# Altium schematic sheet [4] MCU.SchDoc
size A3
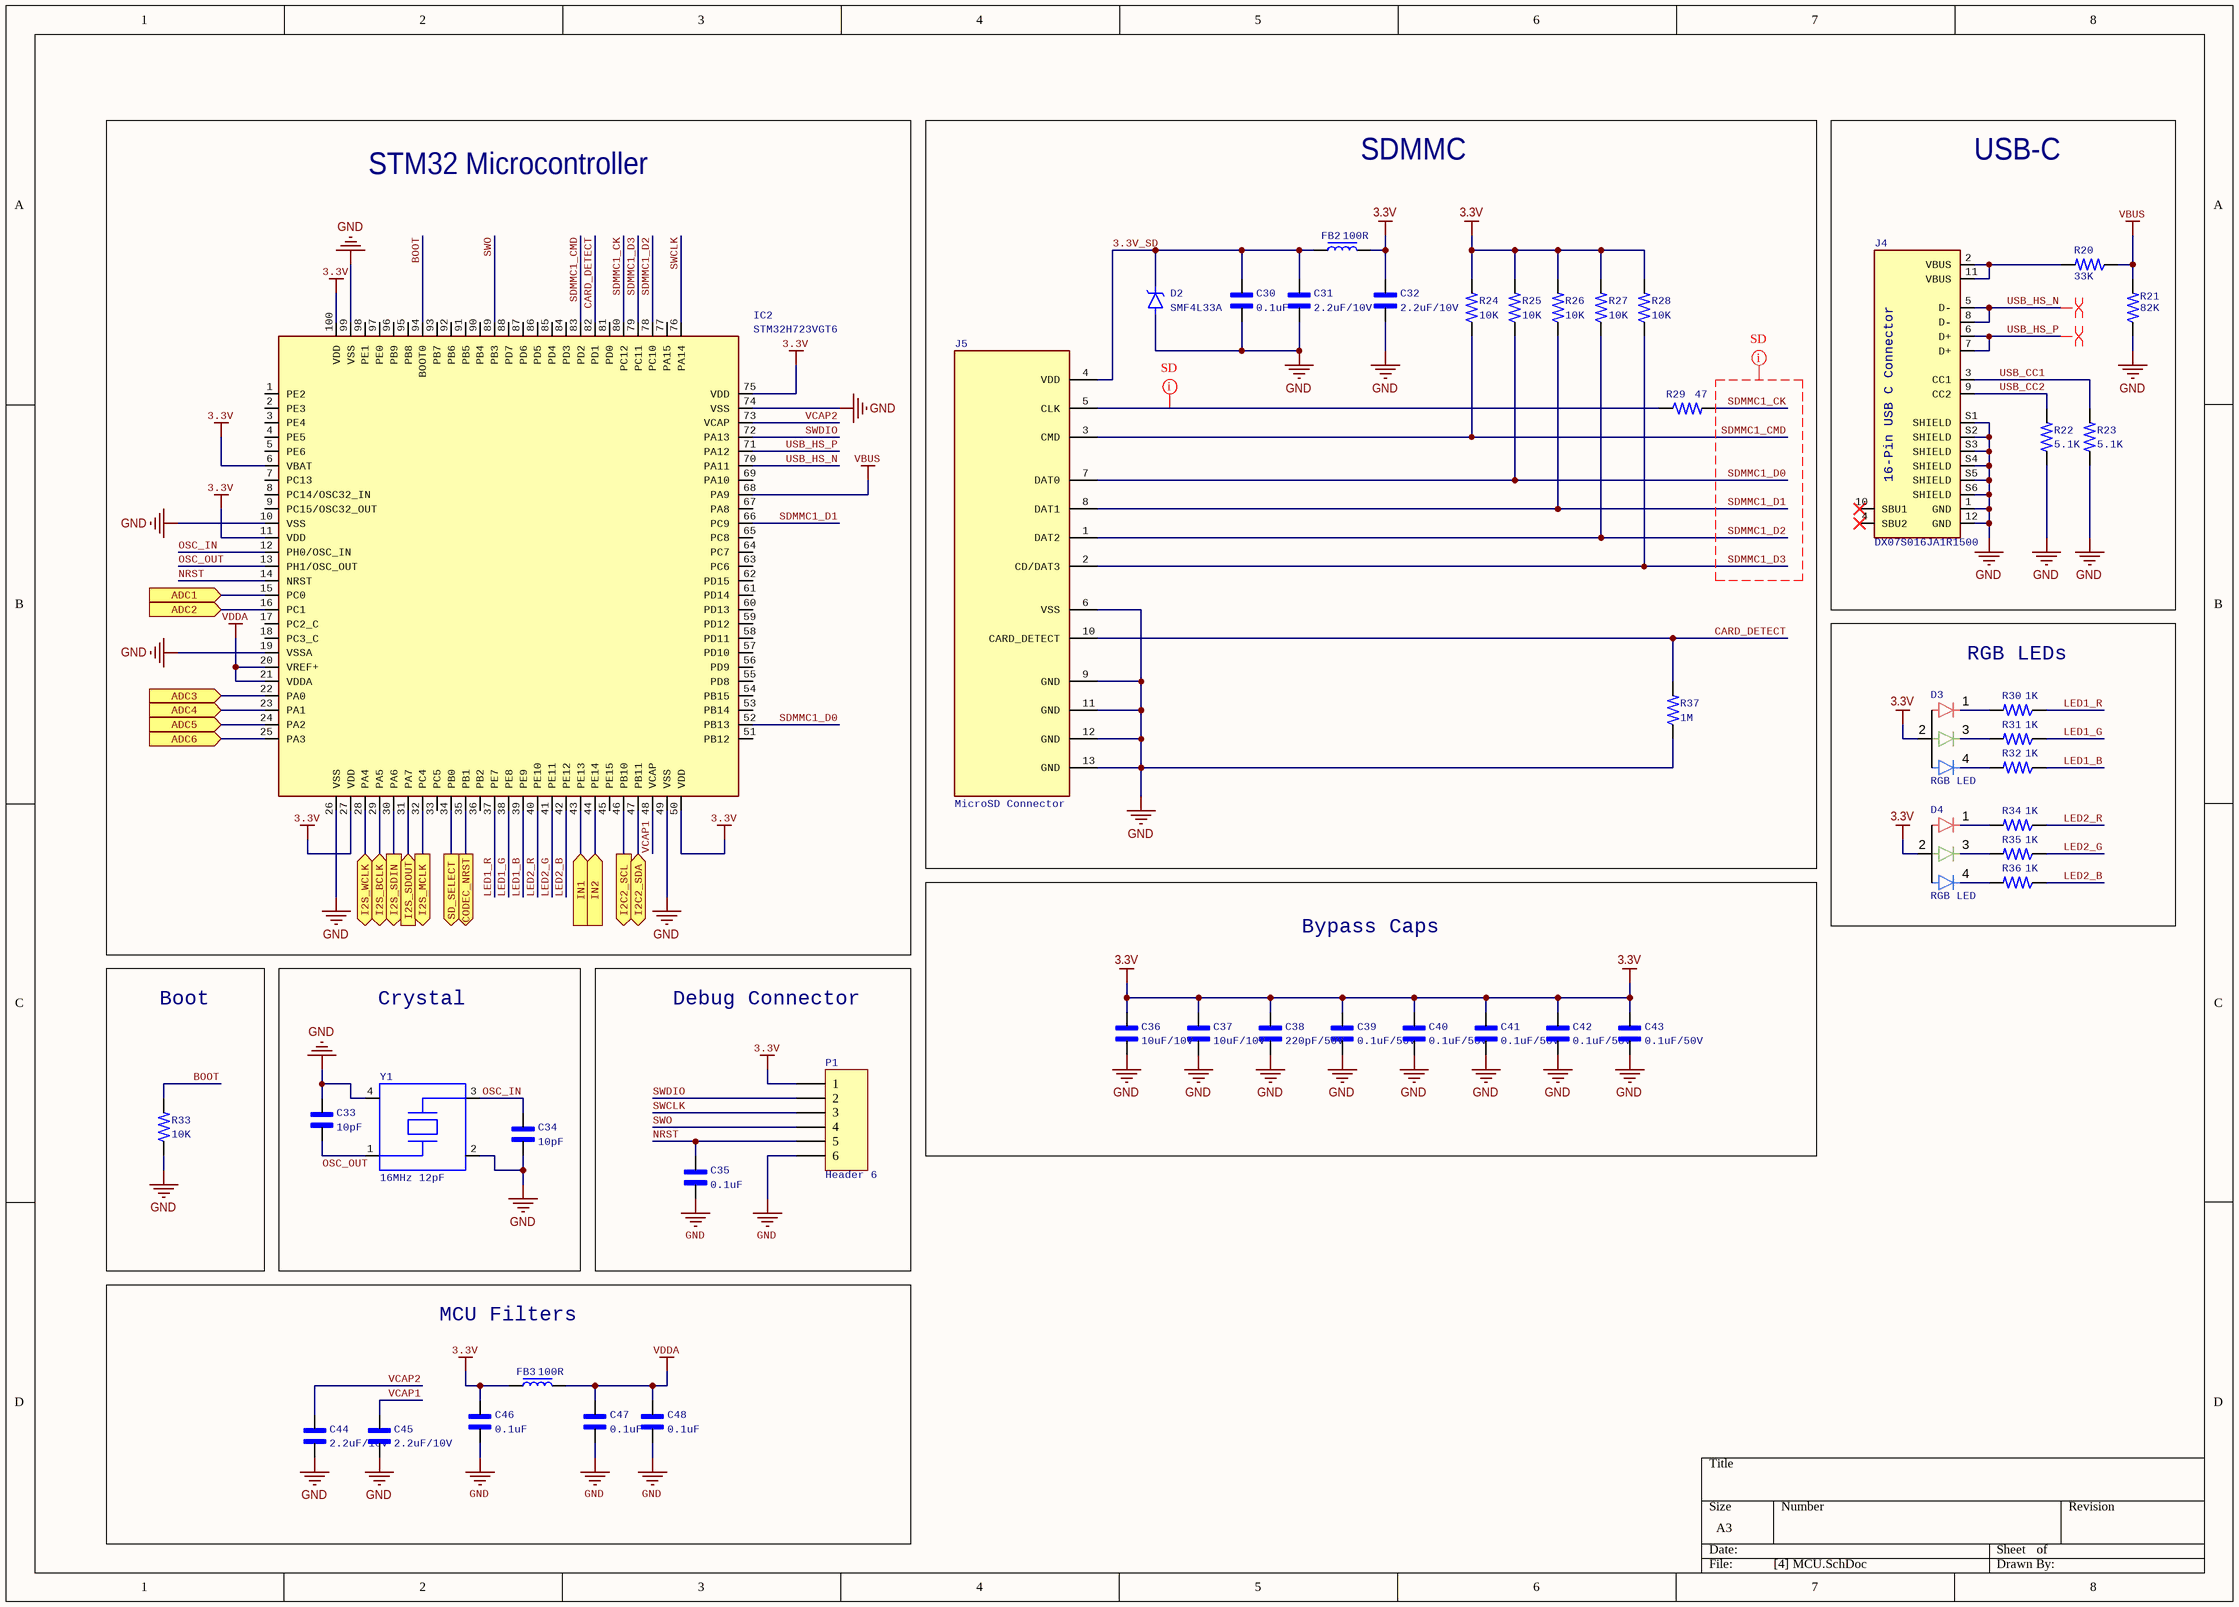
[diagram p0: [4] MCU.SchDoc]

## Parts
C30  0.1uF  [C0603]
C31  2.2uF/10V  [C0603]
C32  2.2uF/10V  [C0603]
C33  10pF  [C0603]
C34  10pF  [C0603]
C35  0.1uF  [C0603]
C36  10uF/10V  [C0603]
C37  10uF/10V  [C0603]
C38  220pF/50V  [C0603]
C39  0.1uF/50V  [C0603]
C40  0.1uF/50V  [C0603]
C41  0.1uF/50V  [C0603]
C42  0.1uF/50V  [C0603]
C43  0.1uF/50V  [C0603]
C44  2.2uF/10V  [C0603]
C45  2.2uF/10V  [C0603]
C46  0.1uF  [C0603]
C47  0.1uF  [C0603]
C48  0.1uF  [C0603]
D2  SMF4L33A  [SOD-123FL]
D3  RGB LED  [RGB LED CA]
D4  RGB LED  [RGB LED CA]
FB2  100R  [FB_0603]
FB3  100R  [FB_0603]
IC2  STM32H723VGT6  [QFP-100]
J4  DX07S016JA1R1500  [USB-C_JAE_DX07S016JA1R1500]
J5  MicroSD Connector  [DM3CSSF]
P1  Header 6  [HDR1X6]  (no BOM)
R20  33K  [R0603]
R21  82K  [R0603]
R22  5.1K  [R0603]
R23  5.1K  [R0603]
R24  10K  [R0603]
R25  10K  [R0603]
R26  10K  [R0603]
R27  10K  [R0603]
R28  10K  [R0603]
R29  47  [R0603]
R30  1K  [R0603]
R31  1K  [R0603]
R32  1K  [R0603]
R33  10K  [R0603]
R34  1K  [R0603]
R35  1K  [R0603]
R36  1K  [R0603]
R37  1M  [R0603]
Y1  16MHz 12pF  [XTAL 3.2 x 2.5 mm]

## Blocks framed on the sheet
STM32 Microcontroller: IC2
SDMMC: C30-C32 D2 FB2 J5 R24-R29 R37
USB-C: J4 R20-R23
RGB LEDs: D3 D4 R30-R32 R34-R36
Bypass Caps: C36-C43
Boot: R33
Crystal: C33 C34 Y1
Debug Connector: C35 P1
MCU Filters: C44-C48 FB3

## Ports
ADC1 (in), ADC2 (in), ADC3 (in), ADC4 (in), ADC5 (in), ADC6 (in), CODEC_NRST (out), I2C2_SCL (out), I2C2_SDA (bidir), I2S_BCLK (bidir), I2S_MCLK (out), I2S_SDIN (out), I2S_SDOUT (in), I2S_WCLK (bidir), IN1 (in), IN2 (in), SD_SELECT (out)

## Nets
3.3V: C32.1 C36.1 C37.1 C38.1 C39.1 C40.1 C41.1 C42.1 C43.1 C46.1 D3.2 D4.2 FB2.2 FB3.1 IC2.6(VBAT) IC2.11(VDD) IC2.27(VDD) IC2.50(VDD) IC2.75(VDD) IC2.100(VDD) P1.1 R24.2 R25.2 R26.2 R27.2 R28.2
GND: C30.2 C31.2 C32.2 C33.1 C34.1 C35.2 C36.2 C37.2 C38.2 C39.2 C40.2 C41.2 C42.2 C43.2 C44.2 C45.2 C46.2 C47.2 C48.2 D2.A IC2.10(VSS) IC2.19(VSSA) IC2.26(VSS) IC2.49(VSS) IC2.74(VSS) IC2.99(VSS) J4.1(GND) J4.12(GND) J4.S1(SHIELD) J4.S2(SHIELD) J4.S3(SHIELD) J4.S4(SHIELD) J4.S5(SHIELD) J4.S6(SHIELD) J5.6(VSS) J5.9(GND) J5.11(GND) J5.12(GND) J5.13(GND) P1.6 R21.1 R22.1 R23.1 R33.1 R37.1 Y1.2 Y1.4
VBUS: IC2.68(PA9) R20.1 R21.2
VDDA: C47.1 C48.1 FB3.2 IC2.20(VREF+) IC2.21(VDDA)
3.3V_SD: C30.1 C31.1 D2.C FB2.1 J5.4(VDD)
ADC1: IC2.15(PC0) ; port ADC1
ADC2: IC2.16(PC1) ; port ADC2
ADC3: IC2.22(PA0) ; port ADC3
ADC4: IC2.23(PA1) ; port ADC4
ADC5: IC2.24(PA2) ; port ADC5
ADC6: IC2.25(PA3) ; port ADC6
BOOT: IC2.94(BOOT0) R33.2
CARD_DETECT: IC2.82(PD1) J5.10(CARD_DETECT) R37.2
CODEC_NRST: IC2.35(PB1) ; port CODEC_NRST
I2C2_SCL: IC2.46(PB10) ; port I2C2_SCL
I2C2_SDA: IC2.47(PB11) ; port I2C2_SDA
I2S_BCLK: IC2.29(PA5) ; port I2S_BCLK
I2S_MCLK: IC2.32(PC4) ; port I2S_MCLK
I2S_SDIN: IC2.30(PA6) ; port I2S_SDIN
I2S_SDOUT: IC2.31(PA7) ; port I2S_SDOUT
I2S_WCLK: IC2.28(PA4) ; port I2S_WCLK
IN1: IC2.43(PE13) ; port IN1
IN2: IC2.44(PE14) ; port IN2
LED1_B: IC2.39(PE9) R32.1
LED1_G: IC2.38(PE8) R31.1
LED1_R: IC2.37(PE7) R30.1
LED2_B: IC2.42(PE12) R36.1
LED2_G: IC2.41(PE11) R35.1
LED2_R: IC2.40(PE10) R34.1
NRST: C35.1 IC2.14(NRST) P1.5
OSC_IN: C34.2 IC2.12(PH0/OSC_IN) Y1.3
OSC_OUT: C33.2 IC2.13(PH1/OSC_OUT) Y1.1
SD_SELECT: IC2.34(PB0) ; port SD_SELECT
SDMMC1_CK: IC2.80(PC12) R29.2
SDMMC1_CMD: IC2.83(PD2) J5.3(CMD) R24.1
SDMMC1_D0: IC2.52(PB13) J5.7(DAT0) R25.1
SDMMC1_D1: IC2.66(PC9) J5.8(DAT1) R26.1
SDMMC1_D2: IC2.78(PC10) J5.1(DAT2) R27.1
SDMMC1_D3: IC2.79(PC11) J5.2(CD/DAT3) R28.1
SWCLK: IC2.76(PA14) P1.3
SWDIO: IC2.72(PA13) P1.2
SWO: IC2.89(PB3) P1.4
USB_CC1: J4.3(CC1) R23.2
USB_CC2: J4.9(CC2) R22.2
USB_HS_N: IC2.70(PA11) J4.5(D-) J4.8(D-)
USB_HS_P: IC2.71(PA12) J4.6(D+) J4.7(D+)
VCAP1: C45.1 IC2.48(VCAP)
VCAP2: C44.1 IC2.73(VCAP)
NetD3_1: D3.1(R) R30.2
NetD3_3: D3.3 R31.2
NetD3_4: D3.4 R32.2
NetD4_1: D4.1(R) R34.2
NetD4_3: D4.3 R35.2
NetD4_4: D4.4 R36.2
NetJ4_2: J4.2(VBUS) J4.11(VBUS) R20.2
NetJ5_5: J5.5(CLK) R29.1

Not connected (* = marked no-connect by the designer): IC2 1(PE2) 2(PE3) 3(PE4) 4(PE5) 5(PE6) 7(PC13) 8(PC14/OSC32_IN) 9(PC15/OSC32_OUT) 17(PC2_C) 18(PC3_C) 33(PC5) 36(PB2) 45(PE15) 51(PB12) 53(PB14) 54(PB15) 55(PD8) 56(PD9) 57(PD10) 58(PD11) 59(PD12) 60(PD13) 61(PD14) 62(PD15) 63(PC6) 64(PC7) 65(PC8) 67(PA8) 69(PA10) 77(PA15) 81(PD0) 84(PD3) 85(PD4) 86(PD5) 87(PD6) 88(PD7) 90(PB4) 91(PB5) 92(PB6) 93(PB7) 95(PB8) 96(PB9) 97(PE0) 98(PE1); J4 4(SBU2)* 10(SBU1)*

## Layout directives
net class SD: NetJ5_5, SDMMC1_CK, SDMMC1_CMD, SDMMC1_D0, SDMMC1_D1, SDMMC1_D2, SDMMC1_D3
differential pair; differential pair class USB: USB_HS_N, USB_HS_P

## Notes on the sheet
- (in symbol USB C 16-Pin) 16-Pin USB C Connector

## Library data of the parts
C30 C35 C39-C43 C46-C48 = C0603 0.1uF/50V: MLCC 0.1uF 50V X5R 10% 0603; Manufacturer: TDK; Manufacturer Part Number: C1608X5R1H104K080AA; Dielectric Material: Ceramic; Capacitance: 100nF; Supplier 1: Mouser; Supplier Part Number 1: 810-C1608X5R1H104K; RoHS: Yes; Category: Ceramic Capacitors; Stock 1: 520600; Pricing 1: 1=0.12000, 10=0.04500, 100=0.03700, 500=0.02600, 1000=0.02100, 4000=0.01800 (USD); Mount: Surface Mount; Case/Package: 0603; Number of Pins: 2; Case Code (Metric): 1608; Case Code (Imperial): 0603; Weight: 7.1E-05oz; Min Operating Temperature: -55°C; Max Operating Temperature: 85°C; Tolerance: 10%; Dielectric: X5R; Voltage Rating: 50V; Packaging: Tape and Reel; Voltage Rating (DC): 50V; Termination: SMD/SMT; Package Quantity: 1; Resistor Type: Ceramic; Length: 1.6mm; Width: 0.031inch; Height: 0.8mm; Depth: 0.8mm; Thickness: 0.035inch; Radiation Hardening: No; REACH SVHC: No SVHC; Lead Free: Lead Free; Supplier 2: Mouser; Supplier Part Number 2: 187-CL10B104KB8NNNC
C31 C32 C44 C45 = C0603 2.2uF/10V: MLCC 2.2uF 10V X5R 10% 0603; Manufacturer: Samsung; Manufacturer Part Number: CL10A225KP8NNNC; Material: Ceramic; Supplier 1: Mouser; Supplier Part Number 1: 187-CL10A225KP8NNNC; RoHS: Yes; Category: Ceramic Capacitors; Stock 1: 763370; Pricing 1: 1=0.10000, 10=0.06100, 100=0.02700, 500=0.01900, 1000=0.01500, 2500=0.01100 (USD); Mount: Surface Mount; Case/Package: 0603; Case Code (Metric): 1608; Case Code (Imperial): 0603; Min Operating Temperature: -55°C; Max Operating Temperature: 85°C; Tolerance: 10%; Capacitance: 2.2uF; Dielectric: X5R; Package Quantity: 1; Packaging: Tape and Reel; Voltage Rating: 10V; Voltage: 10V; Voltage Rating (DC): 10V; Length: 1.6mm; Width: 0.031inch; Height: 0.8mm; Thickness: 0.035inch; Depth: 0.8mm; Radiation Hardening: No; Lead Free: Lead Free
C33 C34 = C0603 10pF/50V: MLCC 10pF 50V X7R 10% 0603; Manufacturer: KEMET; Manufacturer Part Number: C0603C100K5RACTU; Dielectric Material: Ceramic; Supplier 1: Mouser; Supplier Part Number 1: 80-C0603C100K5R; RoHS: No; Category: Ceramic Capacitors; Stock 1: 10694; Pricing 1: 1=0.24000, 10=0.11000, 50=0.11000, 100=0.09400, 1000=0.05800, 10000=0.04100 (USD); Case/Package: 0603; Voltage Rating (DC): 50V; Dielectric: X7R; Tolerance: 10%; Capacitance: 10pF; Supplier 2: Mouser; Supplier Part Number 2: 581-06035C100KAT2A
C36 C37 = C0603 10uF/10V: MLCC 10uF 10V X5R 20% 0603; Manufacturer: KEMET; Manufacturer Part Number: C0603C106M8PAC7867; Supplier 1: Mouser; Supplier Part Number 1: 80-C0603C106M8PACTU; RoHS: Yes; Category: Ceramic Capacitors; Stock 1: 19357; Pricing 1: 1=0.46000, 10=0.24500, 50=0.24500, 100=0.21300, 1000=0.13400, 10000=0.10600 (USD); Supplier 2: Digi-Key; Supplier Part Number 2: 399-14945-6-ND; Mount: Surface Mount; Case/Package: 0603; Case Code (Imperial): 0603; Case Code (Metric): 1608; Min Operating Temperature: -55°C; Max Operating Temperature: 85°C; Packaging: Cut Tape; Capacitance: 10uF; Tolerance: 20%; Voltage Rating: 10V; RoHS Compliant: Yes
C38 = C0603 220pF/50V: MLCC 220pF 50V X7R 10% 0603; Manufacturer: KEMET; Manufacturer Part Number: C0603C221K5RACTU; Dielectric Material: Ceramic; Supplier 1: Mouser; Supplier Part Number 1: 80-C0603C221K5R; RoHS: Yes; Category: Ceramic Capacitors; Stock 1: 91306; Pricing 1: 1=0.10000, 10=0.03100, 100=0.02100, 500=0.01800, 1000=0.01400, 4000=0.01100 (USD); Mount: Surface Mount; Case/Package: 0603; Min Operating Temperature: -55°C; Max Operating Temperature: 125°C; Packaging: Tape and Reel; Tolerance: 10%; Capacitance: 220pF; Dielectric: X7R; Termination: SMD/SMT; Voltage Rating (DC): 50V; Voltage: 50V; Length: 1.6mm; Height: 0.8mm; Depth: 0.8mm; Radiation Hardening: No
D2 = ESD Diode SMF4L33A: TVS DIODE, 2KW, 33V, UNIDIR, SOD-123FL; Manufacturer: Littelfuse; Number of Unidirectional Channels: 1; Min Breakdown Voltage: 36.7V; Clamping Voltage: 53.3V; Peak Pulse Current: 7.5A; Peak Pulse Power: 400W; Power Line Protection: No; Supplier 1: Mouser; Supplier Part Number 1: 576-SMF4L33A; Manufacturer Part Number: SMF4L33A; RoHS: Yes; Category: TVS Diodes; Stock 1: 5344; Pricing 1: 1=0,46000, 10=0,30000, 50=0,30000, 100=0,16700, 1000=0,12500, 10000=0,10100 (USD); Mount: Surface Mount; Min Operating Temperature: -55°C; Max Operating Temperature: 150°C; Resistor Type: Zener; Packaging: Tape and Reel; Reverse Standoff Voltage: 33V; RoHS Compliant: Yes
D3 D4 = RGB LED CA PTH: LED RGB CLEAR T-1 3/4 T/H CA; Manufacturer: Kingbright; Manufacturer Part Number: WP154A4SEJ3VBDZGC/CA; Supplier 1: Mouser; Supplier Part Number 1: 604-WP154A43VBDZGCCA; RoHS: No; Category: LEDs; Stock 1: 4623; Pricing 1: 1=1.99000, 10=1.51000, 100=1.05000, 250=1.02000, 500=0.93600, 1000=0.83500 (USD)
FB2 FB3 = FB_0603: Ferrite Bead SMD 0603
IC2 = STM32H723VGT6: MCU 32-bit ARM Cortex M7 RISC 1MB Flash 1.8V/2.5V/3.3V 100-Pin LQFP Tray; Manufacturer: STMicroelectronics; Supplier 1: Mouser; Manufacturer Part Number: STM32H723VGT6; RoHS: Yes; Category: Microcontrollers; Stock 1: 2663; Pricing 1: 1=12.88, 10=11.84, 50=10.07, 100=10, 1000=8.84, 10000=8.84 (USD); Supplier Part Number 1: 511-STM32H723VGT6
J4 = USB C 16-Pin: USB-C (USB TYPE-C) USB 2.0 Receptacle Connector 24 (16+8 Dummy) SMT, Right Angle; Through Hole; Manufacturer: JAE Electronics; Supplier 1: Mouser; Supplier Part Number 1: 656-DX07S016JA1R1500; Manufacturer Part Number: DX07S016JA1R1500; RoHS: No; Stock 1: 11168; Pricing 1: 1=1.51000, 10=1.23000, 50=1.23000, 100=1.17000, 1000=0.83900, 10000=0.72800 (USD)
J5 = DM3CS-SF: Connector, Memory, Micro Sd, DM3CS-SF; Manufacturer: Hirose; Pitch: 1.1mm; Current Rating: 500mA; Voltage Rating (AC): 125V; Gender: Female; Insulation Resistance: 1GR; Number of Positions: 8; Contact Resistance: 100mR; Connector Type: Connector; Packaging: Tape and Reel; Flammability Rating: UL94 V-0; Min Operating Temperature: -25°C; Orientation: Right Angle; Width: 13.8mm; Number of Rows: 1; Housing Material: Polymer; Mount: Surface Mount; Max Current Rating: 500mA; Radiation Hardening: No; Max Operating Temperature: 85°C; Contact Plating: Gold; Depth: 1.83mm; Contact Material: Gold,Copper Alloy,Copper; Length: 14.1mm; Number of Contacts: 8; Termination: Solder; Supplier 1: Mouser; RoHS: Yes; Category: Memory Connectors; Stock 1: 85183; Pricing 1: 1=1.55, 10=1.27, 50=1.27, 100=1.1, 1000=1.01, 10000=0.748 (USD); Series: DM3; RoHS Compliant: Yes; Reach SVHC Compliant: Unknown; Supplier Part Number 1: 798-DM3CSSF; Manufacturer Part Number: DM3CS-SF
P1 = Header 6: Header, 6-Pin; LatestRevisionDate: 17-Jul-2002; LatestRevisionNote: Re-released for DXP Platform.; Publisher: Altium Limited
R20 = R0603 33K: RES 0603 33K 1% 1/10W; Manufacturer: Yageo; Manufacturer Part Number: AC0603FR-1333KL; Supplier 1: Mouser; Supplier Part Number 1: 603-AC0603FR-1333KL; RoHS: Yes; Category: Chip SMD Resistors; Stock 1: 42354; Pricing 1: 1=0,10000, 10=0,03000, 50=0,03000, 100=0,01300, 1000=0,00600, 10000=0,00400 (USD); RoHS Compliant: Yes
R21 = R0603 82K: RES 0603 82K OHM 0.5% 1/10W; Manufacturer: Yageo; Manufacturer Part Number: RC0603FR-0782KL; Tolerance: 1%; Resistance: 82kR; Power Rating: 100mW; Voltage Rating: 75V; Voltage Rating (DC): 50V; Temperature Coefficient: 100ppm/°C; Supplier 1: Mouser; Supplier Part Number 1: 603-RC0603FR-0782KL; RoHS: Yes; Category: Chip SMD Resistors; Stock 1: 4847; Pricing 1: 1=0.10000, 10=0.01800, 50=0.01800, 100=0.00600, 1000=0.00500, 10000=0.00300 (USD); Case/Package: 0603; Number of Pins: 2; Case Code (Imperial): 0603; Case Code (Metric): 1608; Weight: 7.1E-05oz; Size Code: 0603; Min Operating Temperature: -55°C; Max Operating Temperature: 155°C; Packaging: Tape and Reel; Termination: SMD/SMT; Resistor Type: Thick Film; Features: Moisture Resistant; Series: RC; Max Power Dissipation: 100mW; Number of Terminations: 2; Construction: Rectangular; Technology: THICK FILM; Resistance Tolerance: 1%; Length: 1.6mm; Width: 0.8mm; Height: 0.45mm; Depth: 0.8mm; REACH SVHC: No SVHC; Military Standard: Not; Lead Free: Lead Free; RoHS Compliant: Yes
R22 R23 = R0603 5.1K: RES 0603 5.1K OHM 1% 1/10W; Manufacturer: Yageo; Manufacturer Part Number: RC0603FR-075K1L; Power Rating: 100mW; Temperature Coefficient: 100ppm/°C; Resistance: 5.1kR; Voltage Rating: 50V; Supplier 1: Mouser; Supplier Part Number 1: 603-RC0603FR-075K1L; RoHS: Yes; Category: Chip SMD Resistors; Stock 1: 557916; Case/Package: 0603; Number of Pins: 2; Case Code (Imperial): 0603; Case Code (Metric): 1608; Min Operating Temperature: -55°C; Max Operating Temperature: 155°C; Tolerance: 1%; Packaging: Tape and Reel; Package Quantity: 1; Termination: SMD/SMT; Resistor Type: Thick Film; Number of Terminations: 2; Max Power Dissipation: 100mW; Voltage Rating (DC): 50V; Features: Moisture Resistant; Length: 0.063inch; Width: 0.031inch; Height: 0.022inch; Depth: 0.8mm; REACH SVHC: No SVHC; Military Standard: Not; Lead Free: Lead Free
R24-R28 R33 = R0603 10K: RES 0603 10K OHM 1% 1/10W; Manufacturer: Yageo; Manufacturer Part Number: RC0603FR-1310KL; Resistance: 10kR; Power Rating: 100mW; Voltage Rating: 50V; Temperature Coefficient: 100ppm/°C; Supplier 1: Mouser; Supplier Part Number 1: 603-RC0603FR-1310KL; RoHS: Yes; Category: Chip SMD Resistors; Stock 1: 50990; Pricing 1: 1=0.10000, 10=0.01800, 50=0.01800, 100=0.00600, 1000=0.00500, 2500=0.00400, 10000=0.00400 (USD); Case/Package: 0603; Number of Pins: 2; Case Code (Imperial): 0603; Case Code (Metric): 1608; Size Code: 0603; Min Operating Temperature: -55°C; Max Operating Temperature: 155°C; Tolerance: 1%; Packaging: Tape and Reel; Resistor Type: Thick Film; Termination: SMD/SMT; Voltage Rating (DC): 50V; Series: RC; Resistance Tolerance: 1%; Construction: Rectangular; Length: 1.6mm; Depth: 0.8mm; RoHS Compliant: Yes; REACH SVHC: No SVHC; Military Standard: Not; Lead Free: Lead Free; ComponentLink1URL: https://datasheet.ciiva.com/7983/443971-7983673.pdf?src-supplier=Element14; ComponentLink1Description: https://datasheet.ciiva.com/7983/443971-7983673.pdf?src-supplier=Element14; ComponentLink2URL: https://datasheet.ciiva.com/16850/pyu-rc0603-51-rohs-l-4-16850349.pdf?src-supplier=Future+Electronics; ComponentLink2Description: https://datasheet.ciiva.com/16850/pyu-rc0603-51-rohs-l-4-16850349.pdf?src-supplier=Future+Electronics
R29 = R0603 47: RES 0603 47 1% 1/10W; Manufacturer: Yageo; Manufacturer Part Number: RC0603FR-0747RL; Resistance: 47R; Power Rating: 100mW; Voltage Rating (DC): 50V; Temperature Coefficient: 100ppm/°C; Voltage Rating: 75V; Supplier 1: Mouser; Supplier Part Number 1: 603-RC0603FR-0747RL; RoHS: Yes; Category: Chip SMD Resistors; Stock 1: 267107; Case/Package: 0603; Number of Pins: 2; Case Code (Imperial): 0603; Case Code (Metric): 1608; Weight: 7.1E-05oz; Min Operating Temperature: -55°C; Max Operating Temperature: 155°C; Tolerance: 1%; Packaging: Tape and Reel; Package Quantity: 1; Termination: SMD/SMT; Resistor Type: Thick Film; Number of Terminations: 2; Max Power Dissipation: 100mW; Features: Moisture Resistant; Length: 1.6mm; Width: 0.8mm; Height: 0.45mm; Depth: 0.8mm; REACH SVHC: Unknown; Lead Free: Lead Free; Military Standard: Not
R30-R32 R34-R36 = R0603 1K: RES 0603 1K OHM 1% 1/10W; Manufacturer: Yageo; Manufacturer Part Number: RC0603FR-071KL; Resistance: 1kR; Temperature Coefficient: 100ppm/°C; Power Rating: 100mW; Voltage Rating: 50V; Supplier 1: Mouser; Supplier Part Number 1: 603-RC0603FR-071KL; RoHS: Yes; Category: Chip SMD Resistors; Stock 1: 1697496; Pricing 1: 1=0.10000, 10=0.02100, 50=0.02100, 100=0.00700, 1000=0.00400, 10000=0.00200 (USD); Case/Package: 0603; Contact Plating: Tin,Matte; Case Code (Imperial): 0603; Case Code (Metric): 1608; Size Code: 0603; Min Operating Temperature: -55°C; Max Operating Temperature: 155°C; Tolerance: 1%; Resistor Type: Thick Film; Packaging: Tape and Reel; Termination: SMD/SMT; Features: Moisture Resistant; Series: RC; Max Power Dissipation: 100mW; Number of Terminations: 2; Technology: THICK FILM; Resistance Tolerance: 1%; Construction: Rectangular; Length: 1.6mm; Height: 0.45mm; Depth: 0.8mm; Radiation Hardening: No; REACH SVHC: No SVHC; Military Standard: Not; Lead Free: Lead Free; RoHS Compliant: Yes
R37 = R0603 1M: RES SMD 1M OHM 1% 1/10W 0603; Manufacturer: Yageo; Manufacturer Part Number: RC0603FR-071ML; Voltage Rating: 75V; Voltage Rating (DC): 50V; Resistance: 1MR; Power Rating: 100mW; Temperature Coefficient: 100ppm/°C; Application(s): HIGH RELIABILITY; Supplier 1: Mouser; Supplier Part Number 1: 603-RC0603FR-071ML; RoHS: Yes; Category: Chip SMD Resistors; Stock 1: 1321822; Pricing 1: 1=0.10000, 10=0.01800, 50=0.01800, 100=0.00700, 1000=0.00400, 10000=0.00200 (USD); Case/Package: 0603; Number of Pins: 2; Case Code (Imperial): 0603; Case Code (Metric): 1608; Weight: 0.000847oz; Min Operating Temperature: -55°C; Max Operating Temperature: 155°C; Tolerance: 1%; Packaging: Cut Tape; Package Quantity: 5000; Termination: SMD/SMT; Resistor Type: Thick Film; Type: General Purpose; Series: RC; Technology: THICK FILM; Length: 1.6mm; Width: 0.8mm; Height: 0.45mm; Depth: 0.8mm; RoHS Compliant: Yes; REACH SVHC: No SVHC; Military Standard: Not; Lead Free: Lead Free
Y1 = XTAL 16MHz 12pF: Crystal 16MHz ±50ppm (Tol) ±100ppm (Stability) 12pF FUND 80Ohm 4-Pin SMD T/R; Manufacturer: Kyocera AVX; Manufacturer Part Number: CX3225SB16000H0PSTC1; ESR (Equivalent Series Resistance): 80R; Supplier 1: Mouser; Supplier Part Number 1: 581-CX3225SB16H0PST; RoHS: Yes; Pricing 1: 1=0.69000, 10=0.57500, 50=0.57500, 100=0.46000, 1000=0.36800, 10000=0.34400 (USD); Mount: Surface Mount; Case/Package: SMD/SMT; Min Operating Temperature: -40°C; Max Operating Temperature: 125°C; Packaging: Tape and Reel; Frequency: 16MHz; Frequency Stability: 100ppm; RoHS Compliant: Yes; Stock 1: 2997; Frequency Tolerance: 50ppm; Load Capacitance: 12pF; Category: Crystals; Length: 0.126inch; Width: 0.098inch; Height: 0.024inch; Ratings: AEC-Q200